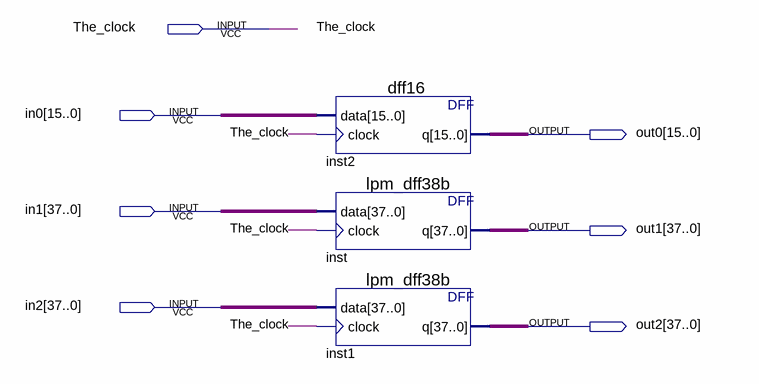
[diagram p0: schematic sheet]
// Quartus schematic Reg_Block.bdf as structural Verilog: 3 symbols, 7 pins
module Reg_Block (
  input  The_clock,
  input  [15:0] in0,
  input  [37:0] in1,
  input  [37:0] in2,
  output [15:0] out0,
  output [37:0] out1,
  output [37:0] out2
);

  dff16 inst2 (.data(in0), .clock(The_clock), .q(out0));
  lpm_dff38b inst (.data(in1), .clock(The_clock), .q(out1));
  lpm_dff38b inst1 (.data(in2), .clock(The_clock), .q(out2));
endmodule
